# Altium schematic sheet Master-using-STM-V1-SCH.SchDoc
size 699 x 699 mm; SheetNumber: 1; SheetTotal: 1
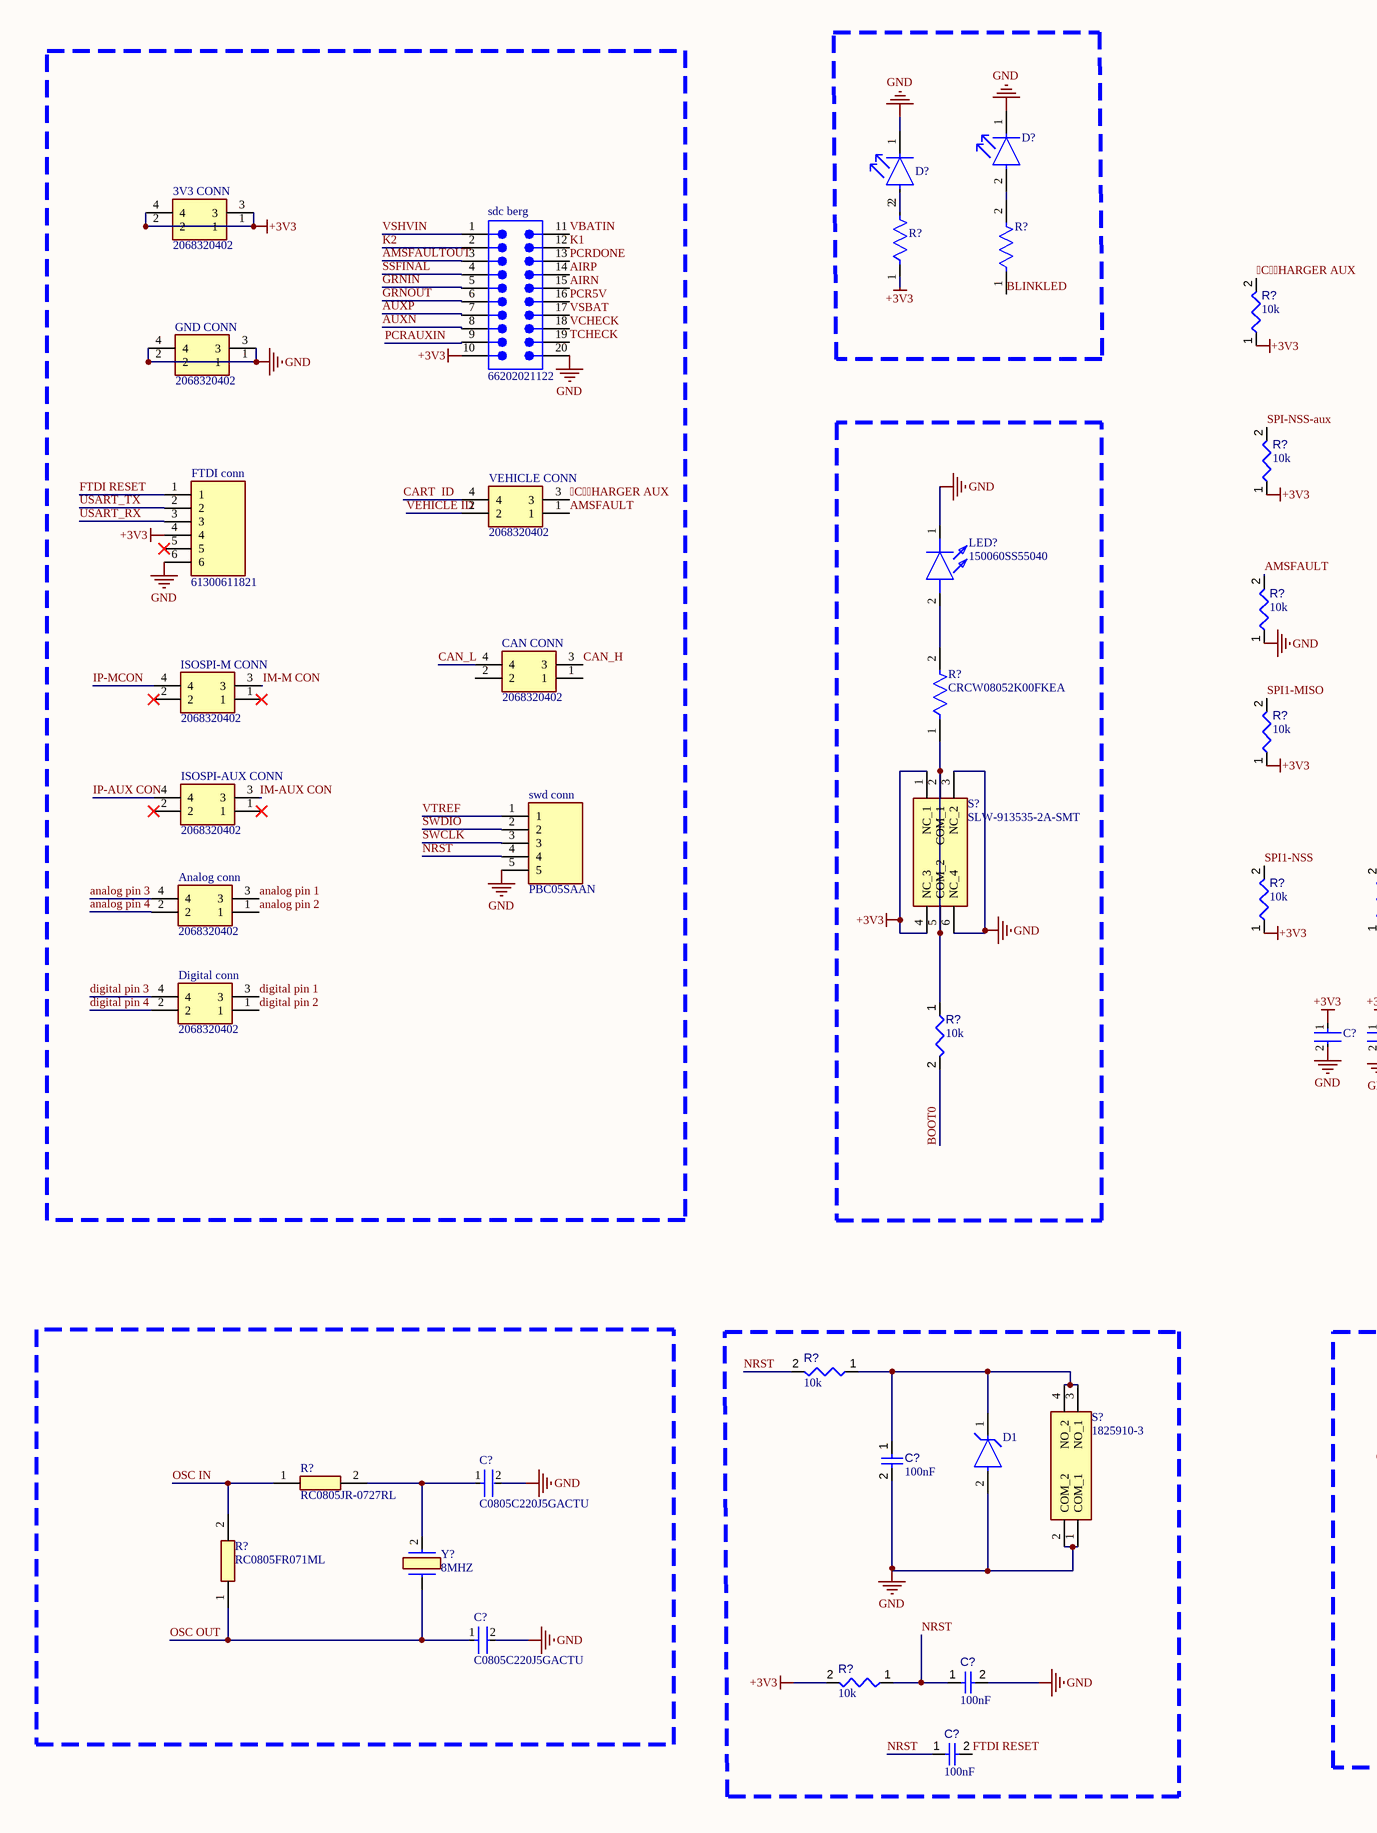
[diagram p0: Master-using-STM-V1-SCH.SchDoc, left]
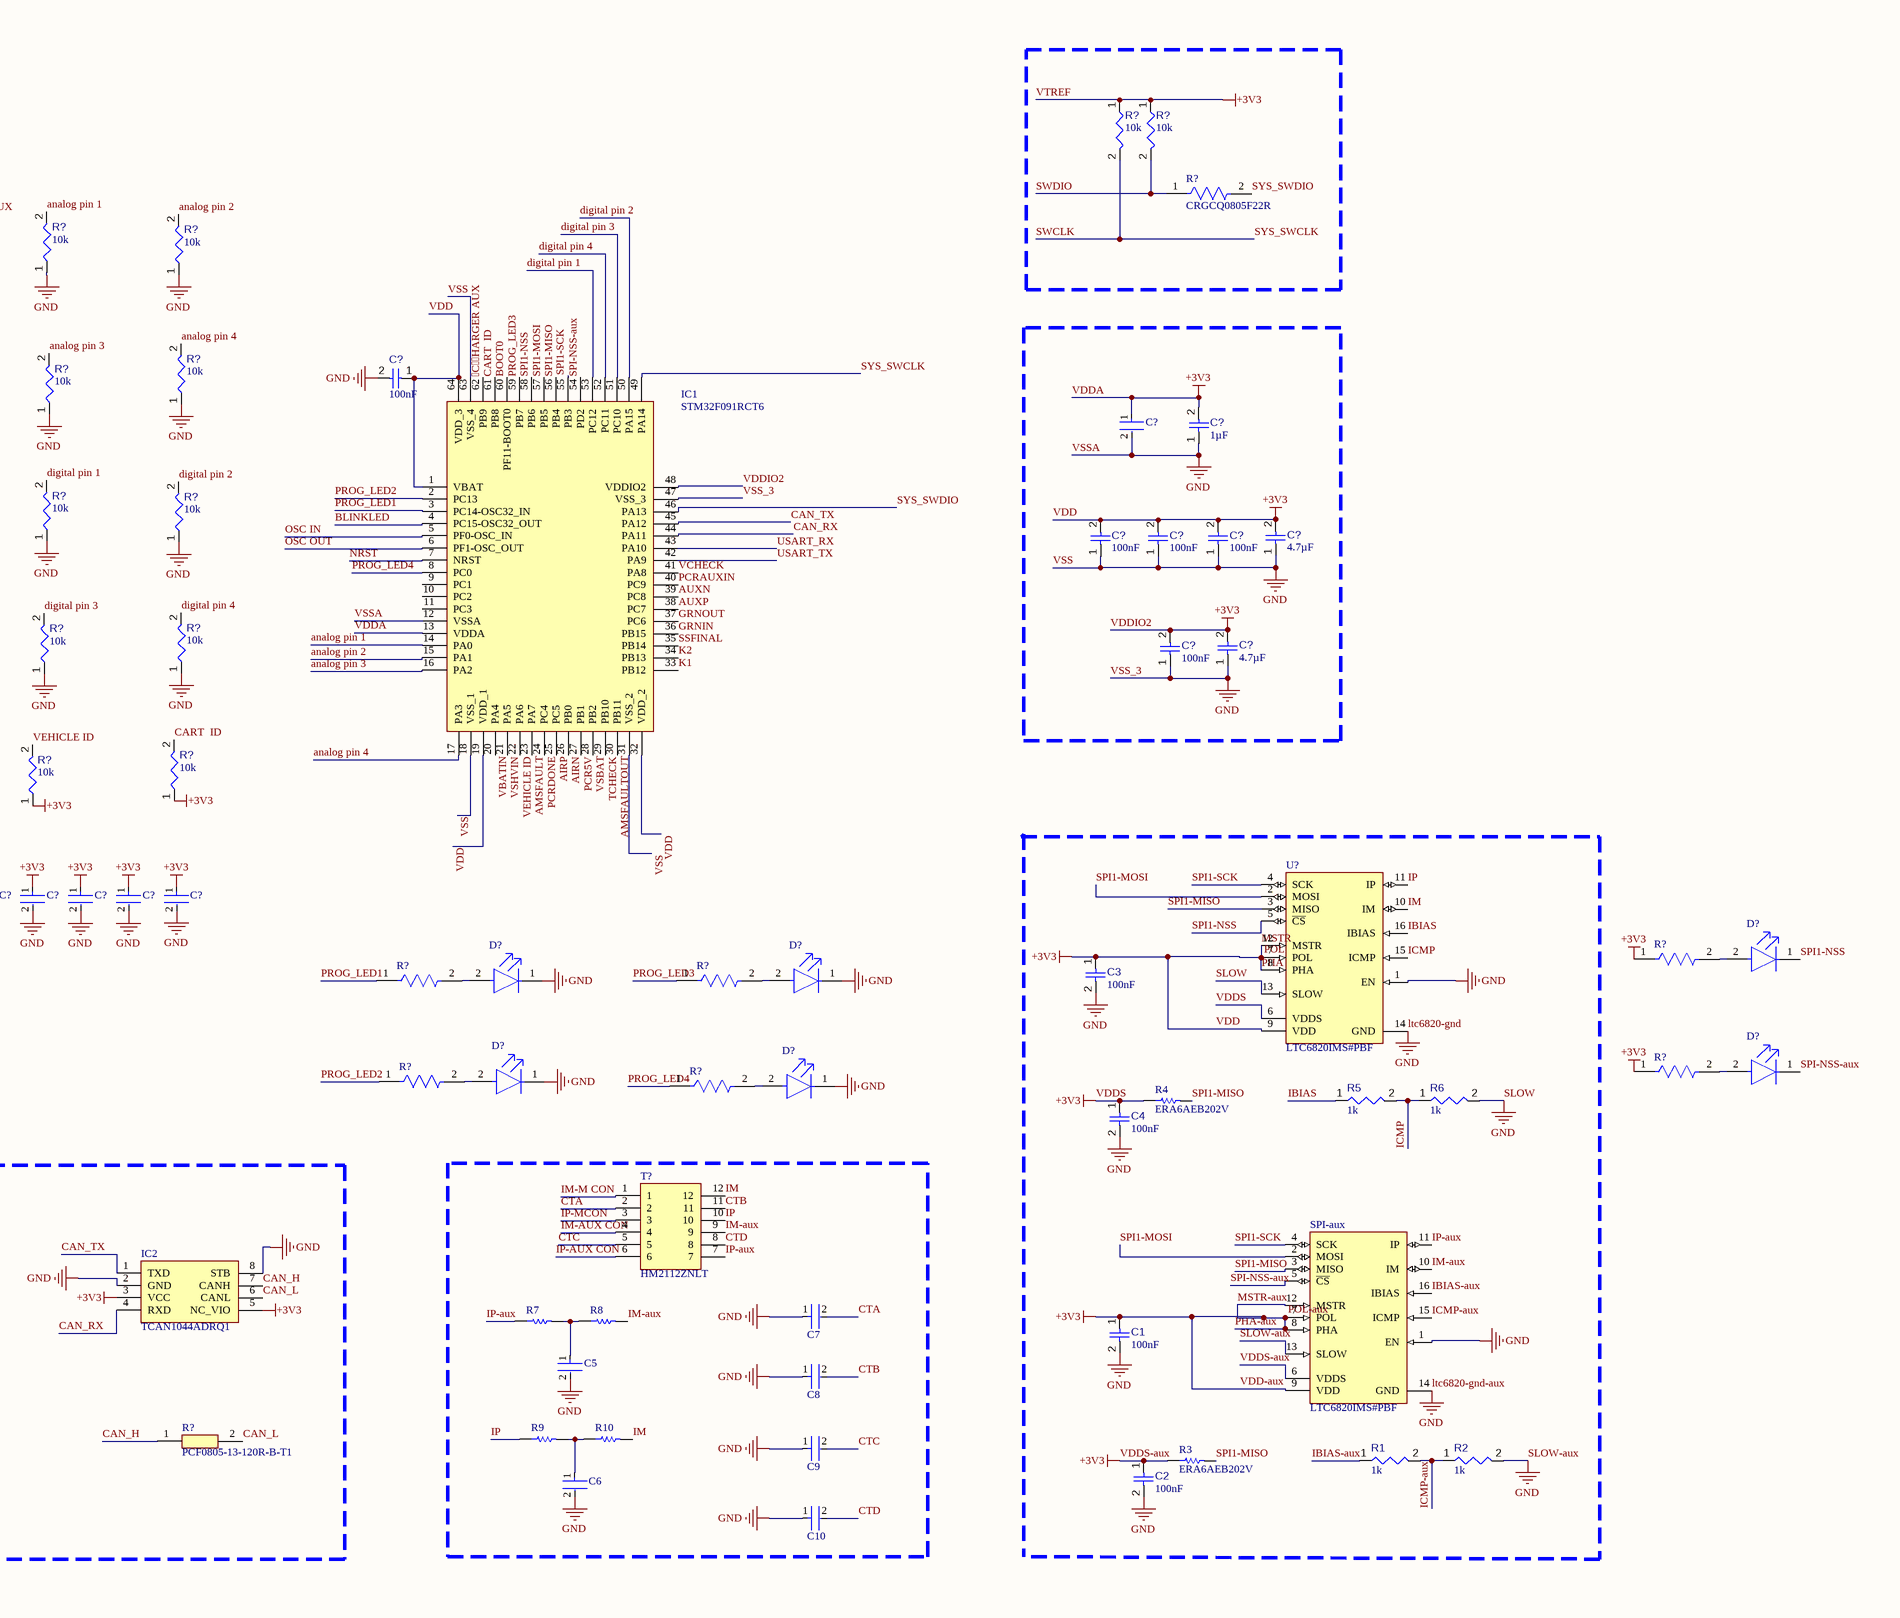
[diagram p1: Master-using-STM-V1-SCH.SchDoc, right]

## Parts
(Parts that share a designator on the sheet are numbered #1, #2 ... from top to bottom, then left to right.)
3V3_CONN  2068320402  [20683204YY]
Analog_conn  2068320402  [20683204YY]
C1  value 100nF  [CAPC2013X95X50LL10T25]  (hidden comment: Capacitor 100 nF +/-10% 50 V 0805)
C2  value 100nF  [CAPC2013X95X50LL10T25]  (hidden comment: Capacitor 100 nF +/-10% 50 V 0805)
C3  value 100nF  [CAPC2013X95X50LL10T25]  (hidden comment: Capacitor 100 nF +/-10% 50 V 0805)
C4  value 100nF  [CAPC2013X95X50LL10T25]  (hidden comment: Capacitor 100 nF +/-10% 50 V 0805)
C5  C0805C103K2RACTU  [FP-C0805C-DN-MFG]  (value not drawn)
C6  C0805C103K2RACTU  [FP-C0805C-DN-MFG]  (value not drawn)
C7  C0805C103K2RACTU  [FP-C0805C-DN-MFG]  (value not drawn)
C8  C0805C103K2RACTU  [FP-C0805C-DN-MFG]  (value not drawn)
C9  C0805C103K2RACTU  [FP-C0805C-DN-MFG]  (value not drawn)
C10  C0805C103K2RACTU  [FP-C0805C-DN-MFG]  (value not drawn)
C?#1  value 100nF  [CAPC2013X95X50LL10T25]  (hidden comment: Capacitor 100 nF +/-10% 50 V 0805)
C?#2  C0805C103K2RACTU  [FP-C0805C-DN-MFG]  (value not drawn)
C?#3  value 1µF  [CAPC2013X145X50ML20T25]  (hidden comment: Capacitor 1 uF +/- 10% 25 V 0805)
C?#4  value 4.7µF  [CAPC0805(2012)145_L]  (hidden comment: Capacitor 4.7µF +/-40% 25V 0805)
C?#5  value 100nF  [CAPC2013X95X50LL10T25]  (hidden comment: Capacitor 100 nF +/-10% 50 V 0805)
C?#6  value 100nF  [CAPC2013X95X50LL10T25]  (hidden comment: Capacitor 100 nF +/-10% 50 V 0805)
C?#7  value 100nF  [CAPC2013X95X50LL10T25]  (hidden comment: Capacitor 100 nF +/-10% 50 V 0805)
C?#8  value 100nF  [CAPC2013X95X50LL10T25]  (hidden comment: Capacitor 100 nF +/-10% 50 V 0805)
C?#9  value 4.7µF  [CAPC0805(2012)145_L]  (hidden comment: Capacitor 4.7µF +/-40% 25V 0805)
C?#10  C0805C103K2RACTU  [FP-C0805C-DN-MFG]  (value not drawn)
C?#11  C0805C103K2RACTU  [FP-C0805C-DN-MFG]  (value not drawn)
C?#12  C0805C103K2RACTU  [FP-C0805C-DN-MFG]  (value not drawn)
C?#13  C0805C103K2RACTU  [FP-C0805C-DN-MFG]  (value not drawn)
C?#14  C0805C103K2RACTU  [FP-C0805C-DN-MFG]  (value not drawn)
C?#15  value 100nF  [CAPC2013X95X50LL10T25]  (hidden comment: Capacitor 100 nF +/-10% 50 V 0805)
C?#16  C0805C220J5GACTU  [FP-C0805C-DN-MFG]
C?#17  C0805C220J5GACTU  [FP-C0805C-DN-MFG]
C?#18  value 100nF  [CAPC2013X95X50LL10T25]  (hidden comment: Capacitor 100 nF +/-10% 50 V 0805)
C?#19  value 100nF  [CAPC2013X95X50LL10T25]  (hidden comment: Capacitor 100 nF +/-10% 50 V 0805)
CAN_CONN  2068320402  [20683204YY]
D1  ESDALC6V1-1U2  [FP-ST0201-MFG]  (value not drawn)
D?#1  SML-LXT0805IW-TR  [FP-SML-LXT0805IW-TR-MFG]  (value not drawn)
D?#2  SML-LXT0805IW-TR  [FP-SML-LXT0805IW-TR-MFG]  (value not drawn)
D?#3  SML-LXT0805IW-TR  [FP-SML-LXT0805IW-TR-MFG]  (value not drawn)
D?#4  SML-LXT0805IW-TR  [FP-SML-LXT0805IW-TR-MFG]  (value not drawn)
D?#5  SML-LXT0805IW-TR  [FP-SML-LXT0805IW-TR-MFG]  (value not drawn)
D?#6  SML-LXT0805IW-TR  [FP-SML-LXT0805IW-TR-MFG]  (value not drawn)
D?#7  SML-LXT0805IW-TR  [FP-SML-LXT0805IW-TR-MFG]  (value not drawn)
D?#8  SML-LXT0805IW-TR  [FP-SML-LXT0805IW-TR-MFG]  (value not drawn)
Digital_conn  2068320402  [20683204YY]
FTDI_conn  61300611821  [RHDR6W97P0X254_1X6_1574X250X865P]
GND_CONN  2068320402  [20683204YY]
IC1  STM32F091RCT6  [QFP50P1200X1200X160-64N]
IC2  TCAN1044ADRQ1  [SOIC127P600X175-8N]
ISOSPI-AUX_CONN  2068320402  [20683204YY]
ISOSPI-M_CONN  2068320402  [20683204YY]
LED?  150060SS55040  [150060SS55040]
R1  value 1k  [RESC0805(2012)_L]  (hidden comment: 1KR5J)
R2  value 1k  [RESC0805(2012)_L]  (hidden comment: 1KR5J)
R3  ERA6AEB202V  [RESC2013X60X40ML20T25]
R4  ERA6AEB202V  [RESC2013X60X40ML20T25]
R5  value 1k  [RESC0805(2012)_L]  (hidden comment: 1KR5J)
R6  value 1k  [RESC0805(2012)_L]  (hidden comment: 1KR5J)
R7  RC0805FR-0749R9L  [RESC2013X60X35LL10T20]  (value not drawn)
R8  RC0805FR-0749R9L  [RESC2013X60X35LL10T20]  (value not drawn)
R9  RC0805FR-0749R9L  [RESC2013X60X35LL10T20]  (value not drawn)
R10  RC0805FR-0749R9L  [RESC2013X60X35LL10T20]  (value not drawn)
R?#1  value 10k  [RESC2013X50X35ML15T15]  (hidden comment: Resistor 10k +/-1% 0805 125 mW)
R?#2  value 10k  [RESC2013X50X35ML15T15]  (hidden comment: Resistor 10k +/-1% 0805 125 mW)
R?#3  CRGCQ0805F22R  [FP-CRGCQ0805-IPC_C]
R?#4  AC0805JR-07680RL  [FP-AC0805-MFG]  (value not drawn)
R?#5  AC0805JR-07680RL  [FP-AC0805-MFG]  (value not drawn)
R?#6  value 10k  [RESC2013X50X35ML15T15]  (hidden comment: Resistor 10k +/-1% 0805 125 mW)
R?#7  value 10k  [RESC2013X50X35ML15T15]  (hidden comment: Resistor 10k +/-1% 0805 125 mW)
R?#8  value 10k  [RESC2013X50X35ML15T15]  (hidden comment: Resistor 10k +/-1% 0805 125 mW)
R?#9  value 10k  [RESC2013X50X35ML15T15]  (hidden comment: Resistor 10k +/-1% 0805 125 mW)
R?#10  value 10k  [RESC2013X50X35ML15T15]  (hidden comment: Resistor 10k +/-1% 0805 125 mW)
R?#11  value 10k  [RESC2013X50X35ML15T15]  (hidden comment: Resistor 10k +/-1% 0805 125 mW)
R?#12  value 10k  [RESC2013X50X35ML15T15]  (hidden comment: Resistor 10k +/-1% 0805 125 mW)
R?#13  value 10k  [RESC2013X50X35ML15T15]  (hidden comment: Resistor 10k +/-1% 0805 125 mW)
R?#14  value 10k  [RESC2013X50X35ML15T15]  (hidden comment: Resistor 10k +/-1% 0805 125 mW)
R?#15  CRCW08052K00FKEA  [FP-CRCW0805-e3-IPC_B]
R?#16  value 10k  [RESC2013X50X35ML15T15]  (hidden comment: Resistor 10k +/-1% 0805 125 mW)
R?#17  value 10k  [RESC2013X50X35ML15T15]  (hidden comment: Resistor 10k +/-1% 0805 125 mW)
R?#18  value 10k  [RESC2013X50X35ML15T15]  (hidden comment: Resistor 10k +/-1% 0805 125 mW)
R?#19  value 10k  [RESC2013X50X35ML15T15]  (hidden comment: Resistor 10k +/-1% 0805 125 mW)
R?#20  value 10k  [RESC2013X50X35ML15T15]  (hidden comment: Resistor 10k +/-1% 0805 125 mW)
R?#21  value 10k  [RESC2013X50X35ML15T15]  (hidden comment: Resistor 10k +/-1% 0805 125 mW)
R?#22  value 10k  [RESC2013X50X35ML15T15]  (hidden comment: Resistor 10k +/-1% 0805 125 mW)
R?#23  AC0805JR-07680RL  [FP-AC0805-MFG]  (value not drawn)
R?#24  AC0805JR-07680RL  [FP-AC0805-MFG]  (value not drawn)
R?#25  AC0805JR-07680RL  [FP-AC0805-MFG]  (value not drawn)
R?#26  AC0805JR-07680RL  [FP-AC0805-MFG]  (value not drawn)
R?#27  AC0805JR-07680RL  [FP-AC0805-MFG]  (value not drawn)
R?#28  AC0805JR-07680RL  [FP-AC0805-MFG]  (value not drawn)
R?#29  value 10k  [RESC2013X50X35ML15T15]  (hidden comment: Resistor 10k +/-1% 0805 125 mW)
R?#30  RC0805JR-0727RL  [RESC2012X60N]
R?#31  RC0805FR071ML  [RESC2012X60N]
R?#32  PCF0805-13-120R-B-T1  [RESC2012X65N]
R?#33  value 10k  [RESC2013X50X35ML15T15]  (hidden comment: Resistor 10k +/-1% 0805 125 mW)
S?#1  SLW-913535-2A-SMT  [SLW9135352ASMT]
S?#2  1825910-3  [18259103]
sdc_berg  66202021122  [66202021122]
SPI-aux  LTC6820IMS#PBF  [LT-MS-16_L]
swd_conn  PBC05SAAN  [HDRV5W64P0X254_1X5_1270X254X858P]
T?  HM2112ZNLT  [HM2112ZNLT]
U?  LTC6820IMS#PBF  [LT-MS-16_L]
VEHICLE_CONN  2068320402  [20683204YY]
Y?  8MHZ  [12000MHzHC494H3050408518pFATF]

## Nets
ltc6820-gnd: C1.2 C2.2 C3.2 C4.2 C5.2 C6.2 C7.1 C8.1 C9.1 C10.1 C?#1.2 C?#2.2 C?#3.1 C?#4.1 C?#5.1 C?#6.1 C?#7.1 C?#8.1 C?#9.1 C?#11.2 C?#12.2 C?#13.2 C?#14.2 C?#15.2 C?#16.2 C?#17.2 C?#18.2 D1.2(A) D?#1.1(C) D?#2.1(C) D?#4.1(C) D?#5.1(C) D?#7.1(C) D?#8.1(C) FTDI_conn.6 GND_CONN.1 GND_CONN.2 GND_CONN.3 GND_CONN.4 IC1.12(VSSA) IC1.18(VSS_1) IC1.31(VSS_2) IC1.47(VSS_3) IC1.63(VSS_4) IC2.2(GND) IC2.8(STB) LED?.1(K) R2.2 R6.2 R?#7.1 R?#8.1 R?#10.1 R?#11.1 R?#12.1 R?#13.1 R?#14.1 R?#17.1 R?#18.1 S?#1.3(NC_2) S?#1.6(NC_4) S?#2.1(COM_1) S?#2.2(COM_2) sdc_berg.20 SPI-aux.1(EN) SPI-aux.13(SLOW) SPI-aux.14(GND) swd_conn.5 U?.1(EN) U?.13(SLOW) U?.14(GND)  [also labelled GND, ltc6820-gnd-aux, SLOW, SLOW-aux, VSS, VSS_3, VSSA]
MSTR: 3V3_CONN.1 3V3_CONN.2 3V3_CONN.3 3V3_CONN.4 C1.1 C2.1 C3.1 C4.1 C?#1.1 C?#2.1 C?#3.2 C?#4.2 C?#5.2 C?#6.2 C?#7.2 C?#8.2 C?#9.2 C?#10.1 C?#11.1 C?#12.1 C?#13.1 C?#14.1 FTDI_conn.4 IC1.1(VBAT) IC1.13(VDDA) IC1.19(VDD_1) IC1.32(VDD_2) IC1.48(VDDIO2) IC1.64(VDD_3) IC2.3(VCC) IC2.5(NC_VIO) R3.1 R4.1 R?#1.1 R?#2.1 R?#4.1 R?#6.1 R?#9.1 R?#16.1 R?#19.1 R?#20.1 R?#21.1 R?#23.1 R?#26.1 R?#33.2 S?#1.1(NC_1) S?#1.4(NC_3) sdc_berg.10 SPI-aux.6(VDDS) SPI-aux.7(POL) SPI-aux.8(PHA) SPI-aux.9(VDD) SPI-aux.12(MSTR) swd_conn.1 U?.6(VDDS) U?.7(POL) U?.8(PHA) U?.9(VDD) U?.12(MSTR)  [also labelled +3V3, MSTR-aux, PHA, PHA-aux, VDD, VDD-aux, VDDA, VDDIO2, VDDS, VDDS-aux, VTREF]
CHARGER AUX: IC1.62(PB9) R?#6.2 VEHICLE_CONN.3
AIRN: IC1.26(PB0) sdc_berg.15
AIRP: IC1.25(PC5) sdc_berg.14
AMSFAULT: IC1.23(PA7) R?#14.2 VEHICLE_CONN.1
AMSFAULTOUT: IC1.30(PB11) sdc_berg.3
analog pin 1: Analog_conn.3 IC1.14(PA0) R?#7.2
analog pin 2: Analog_conn.1 IC1.15(PA1) R?#8.2
analog pin 3: Analog_conn.4 IC1.16(PA2) R?#11.2
analog pin 4: Analog_conn.2 IC1.17(PA3) R?#10.2
AUXN: IC1.39(PC8) sdc_berg.8
AUXP: IC1.38(PC7) sdc_berg.7
BLINKLED: IC1.4(PC15-OSC32_OUT) R?#5.1
BOOT0: IC1.60(PF11-BOOT0) R?#22.2
CAN_H: CAN_CONN.3 IC2.7(CANH) R?#32.1
CAN_L: CAN_CONN.4 IC2.6(CANL) R?#32.2
CAN_RX: IC1.44(PA11) IC2.4(RXD)
CAN_TX: IC1.45(PA12) IC2.1(TXD)
CART  ID: IC1.61(PB8) R?#21.2 VEHICLE_CONN.4
CTA: C7.2 T?.2
CTB: C8.2 T?.11
CTC: C9.2 T?.5
CTD: C10.2 T?.8
digital pin 1: Digital_conn.3 IC1.53(PC12) R?#12.2
digital pin 2: Digital_conn.1 IC1.50(PA15) R?#13.2
digital pin 3: Digital_conn.4 IC1.51(PC10) R?#17.2
digital pin 4: Digital_conn.2 IC1.52(PC11) R?#18.2
FTDI RESET: C?#19.2 FTDI_conn.1
GRNIN: IC1.36(PB15) sdc_berg.5
GRNOUT: IC1.37(PC6) sdc_berg.6
IBIAS: R5.1 U?.16(IBIAS)
IBIAS-aux: R1.1 SPI-aux.16(IBIAS)
ICMP: R5.2 R6.1 U?.15(ICMP)
ICMP-aux: R1.2 R2.1 SPI-aux.15(ICMP)
IM: R10.2 T?.12 U?.10(IM)
IM-aux: R8.2 SPI-aux.10(IM) T?.9
IM-AUX CON: ISOSPI-AUX_CONN.3 T?.4
IM-M CON: ISOSPI-M_CONN.3 T?.1
IP: R9.1 T?.10 U?.11(IP)
IP-aux: R7.1 SPI-aux.11(IP) T?.7
IP-AUX CON: ISOSPI-AUX_CONN.4 T?.6
IP-MCON: ISOSPI-M_CONN.4 T?.3
K1: IC1.33(PB12) sdc_berg.12
K2: IC1.34(PB13) sdc_berg.2
NRST: C?#18.1 C?#19.1 IC1.7(NRST) R?#29.2 R?#33.1 swd_conn.4
OSC IN: IC1.5(PF0-OSC_IN) R?#30.1 R?#31.2
OSC OUT: C?#17.1 IC1.6(PF1-OSC_OUT) R?#31.1 Y?.?1
PCR5V: IC1.27(PB1) sdc_berg.16
PCRAUXIN: IC1.40(PC9) sdc_berg.9
PCRDONE: IC1.24(PC4) sdc_berg.13
PROG_LED1: IC1.3(PC14-OSC32_IN) R?#24.1
PROG_LED2: IC1.2(PC13) R?#27.1
PROG_LED3: IC1.59(PB7) R?#25.1
PROG_LED4: IC1.8(PC0) R?#28.1
SPI1-MISO: IC1.56(PB4) R3.2 R4.2 R?#16.2 SPI-aux.3(MISO) U?.3(MISO)
SPI1-MOSI: IC1.57(PB5) SPI-aux.2(MOSI) U?.2(MOSI)
SPI1-NSS: D?#3.1(C) IC1.58(PB6) R?#19.2 U?.5(~{CS})
SPI1-SCK: IC1.55(PB3) SPI-aux.4(SCK) U?.4(SCK)
SPI-NSS-aux: D?#6.1(C) IC1.54(PD2) R?#9.2 SPI-aux.5(~{CS})
SSFINAL: IC1.35(PB14) sdc_berg.4
SWCLK: IC1.49(PA14) R?#1.2 swd_conn.3  [also labelled SYS_SWCLK]
SWDIO: R?#2.2 R?#3.1 swd_conn.2
SYS_SWDIO: IC1.46(PA13) R?#3.2
TCHECK: IC1.29(PB10) sdc_berg.19
USART_RX: FTDI_conn.3 IC1.43(PA10)
USART_TX: FTDI_conn.2 IC1.42(PA9)
VBATIN: IC1.20(PA4) sdc_berg.11
VCHECK: IC1.41(PA8) sdc_berg.18
VEHICLE ID: IC1.22(PA6) R?#20.2 VEHICLE_CONN.2
VSBAT: IC1.28(PB2) sdc_berg.17
VSHVIN: IC1.21(PA5) sdc_berg.1
NetC5_1: C5.1 R7.2 R8.1
NetC6_1: C6.1 R9.2 R10.1
NetC?#15_1: C?#15.1 D1.1(C) R?#29.1 S?#2.3(NO_1) S?#2.4(NO_2)
NetC?#16_1: C?#16.1 R?#30.2 Y?.2(CRYSTAL_2)
NetD?#1_2: D?#1.2(A) R?#5.2
NetD?#2_2: D?#2.2(A) R?#4.2
NetD?#3_2: D?#3.2(A) R?#23.2
NetD?#4_2: D?#4.2(A) R?#24.2
NetD?#5_2: D?#5.2(A) R?#25.2
NetD?#6_2: D?#6.2(A) R?#26.2
NetD?#7_2: D?#7.2(A) R?#27.2
NetD?#8_2: D?#8.2(A) R?#28.2
NetLED?_2: LED?.2(A) R?#15.2
NetR?#15_1: R?#15.1 R?#22.1 S?#1.2(COM_1) S?#1.5(COM_2)

Not connected (* = marked no-connect by the designer): C?#10 2; CAN_CONN 1 2; FTDI_conn 5*; IC1 9(PC1) 10(PC2) 11(PC3); ISOSPI-AUX_CONN 1* 2*; ISOSPI-M_CONN 1* 2*

## Notes on the sheet
- Labels drawn without touching a wire or pin: GND, POL, POL-aux

## Library data of the parts
3V3_CONN Analog_conn CAN_CONN Digital_conn GND_CONN ISOSPI-AUX_CONN ISOSPI-M_CONN VEHICLE_CONN = 2068320402: Connector; Manufacturer_Name: Molex; Datasheet Link: https://www.molex.com/pdm_docs/sd/2068320201_sd.pdf; Height: 6.7mm; Manufacturer_Part_Number: 2068320402
C1-C4 C?#1 C?#5-C?#8 C?#15 C?#18 C?#19 = CMP-001-00018-6: Chip Capacitor, 100 nF, +/- 10%, 50 V, 0805 (2012 Metric); Capacitor Type: Ceramic; Voltage Rating: 50V; Pins: 2; Max Operating Temperature: 125°C; Min Operating Temperature: -55°C; Mounting Technology: SM; Case/Package: 0805; RoHS Compliant: True; Tolerance: 10%
C5-C10 = CMP-2007-00259-2: CAP CER 10000PF 200V X7R 0805; Manufacturer: KEMET; Material: Ceramic; Temperature Coefficient: 30ppm/°C; Capacitance: 10,000 pF; Tolerance: 0.1; Value: 10,000 pF; Device Class L2: Capacitors; Voltage Rating: 200 V; Temperature Range High: +125°C; ComponentLink2Description: Datasheet; Height: 0.88mm; Octopart: https://octopart.com/c0805c103k2ractu-kemet-9138347; ComponentLink2URL: https://content.kemet.com/datasheets/KEM_C1003_C0G_SMD.pdf; Category: Cap; Temperature: -55°C to +125°C; Temperature Range Low: -55°C; Digikey Description: CAP CER 10000PF 200V X7R 0805; Manufacturer Part Number: C0805C103K2RACTU; Temperature Characteristic: X7R; Automotive: No; Device Class L3: Ceramic Capacitors; Mouser Description: KEMET - C0805C103K2RACTU - CAP, MLCC, X7R, 10NF, 200V, 0805; RoHS: TRUE; Device Class L1: Passive Components; Lead Free: Yes; Package: C0805C-DN; Ipc Land Pattern Name: CAPC200125X78
C?#2 C?#10-C?#14 = CMP-2007-00259-2: CAP CER 10000PF 200V X7R 0805; Manufacturer: KEMET; Material: Ceramic; Temperature Coefficient: 30ppm/°C; Capacitance: 10,000 pF; Description: C0805 10,000 pF X7R 30ppm/°C 10.00% 200 V; Tolerance: 0.1; Value: 10,000 pF; Device Class L2: Capacitors; Voltage Rating: 200 V; Temperature Range High: +125°C; ComponentLink2Description: Datasheet; Height: 0.88mm; Octopart: https://octopart.com/c0805c103k2ractu-kemet-9138347; ComponentLink2URL: https://content.kemet.com/datasheets/KEM_C1003_C0G_SMD.pdf; Category: Cap; Temperature: -55°C to +125°C; Temperature Range Low: -55°C; Digikey Description: CAP CER 10000PF 200V X7R 0805; Manufacturer Part Number: C0805C103K2RACTU; Temperature Characteristic: X7R; Automotive: No; Device Class L3: Ceramic Capacitors; Mouser Description: KEMET - C0805C103K2RACTU - CAP, MLCC, X7R, 10NF, 200V, 0805; RoHS: TRUE; Device Class L1: Passive Components; Lead Free: Yes; Package: C0805C-DN; Ipc Land Pattern Name: CAPC200125X78
C?#3 = CMP-001-00010-6: Chip Capacitor, 1 uF, +/-10%, 25 V, 0805 (2012 Metric); Capacitor Type: Ceramic; Voltage Rating: 25V; RoHS Compliant: True; Pins: 2; Mounting Technology: SM; Max Operating Temperature: 125°C; Min Operating Temperature: -55°C; Tolerance: 10%; Case/Package: 0805
C?#4 C?#9 = CMP-001-00080-4: Chip Capacitor, 4.7µF +/-40%, 25V, 0805, Thickness 1.45 mm; Tolerance: 20%; Voltage Rating: 25V; Min Operating Temperature: -55°C; Max Operating Temperature: 85°C; Pins: 2; Mounting Technology: SMT; Case/Package: 0805
C?#16 C?#17 = CMP-2007-00048-2: Capacitor; Ceramic; Cap; 22.0pF; Tol 5%; SMT; Vol-Rtg 50V; C0G; Tape and Reel; Manufacturer: KEMET; Temperature Coefficient: 30ppm/°C; Capacitance: 22 pF; Value: 22 pF; Description: C0805 22 pF C0G 30ppm/°C 5.00% 50 V; Tolerance: 0.05; Device Class L1: Passive Components; Mouser Description: Multilayer Ceramic Capacitors MLCC - SMD/SMT 50volts 22pF C0G 5%; Temperature Range Low: -55°C; Automotive: No; Voltage Rating: 50 V; Material: Ceramic; Category: Cap; Height: 0.88mm; Temperature Range High: +125°C; Digikey Description: Capacitor; Ceramic; Cap; 22.0pF; Tol 5%; SMT; Vol-Rtg 50V; C0G; Tape and Reel; Octopart: https://octopart.com/c0805c220j5gactu-kemet-145470; ComponentLink2Description: Datasheet; Device Class L2: Capacitors; Ipc Land Pattern Name: CAPC200125X78; RoHS: TRUE; ComponentLink2URL: https://content.kemet.com/datasheets/KEM_C1003_C0G_SMD.pdf; Temperature: -55°C to +125°C; Device Class L3: Ceramic Capacitors; Lead Free: Yes; Manufacturer Part Number: C0805C220J5GACTU; Temperature Characteristic: C0G; Package: C0805C-DN
D1 = CMP-12225-000007-1: TVS DIODE 3V ST0201; Manufacturer: STMicroelectronics; Number Of Channels: 1; Direction: Unidirectional; Max Junction Temp: +125°C; Breakdown Voltage: 6.1V; Capacitance: 12pF; Peak Pulse Current: 2A; Value: 12pF; Peak Pulse Power: 20W; Package: ST0201; Digikey Description: TVS DIODE 3V ST0201; Temperature Range High: +125°C; Octopart: https://octopart.com/esdalc6v1-1u2-stmicroelectronics-11912330; Category: Diode; Height: 0.33mm; RoHS: TRUE; ComponentLink2URL: https://www.st.com/content/ccc/resource/technical/document/datasheet/90/b1/aa/a3/9f/73/4d/1e/CD00212838.pdf/files/CD00212838.pdf/jcr:content/translations/en.CD00212838.pdf; Temperature Range Low: -40°C; Device Class L2: TVS Diodes; ComponentLink2Description: Datasheet; Manufacturer Part Number: ESDALC6V1-1U2; Device Class L1: Circuit Protection; Device Class L3: unset; Lead Free: Yes; Automotive: No; Mouser Description: TVS Diodes - Transient Voltage Suppressors Single-Line Low Cap ESD TVS 0201; Temperature: -40°C to +125°C
D?#1-D?#8 = CMP-1724-00002-2: LED RED DIFFUSED SMD; Lens Style: Rectangular; Luminous Intensity: 11mcd; Approvals: UL; Test Current: 20mA; Forward Voltage: 2V; Number of LEDs: 1; Wavelength: 635nm; Lens Color: White; Viewing Angle: 140°; Min Operating Temperature: -25°C; Case Code (Metric): 2012; Mount: Surface Mount; Case Code (Imperial): 0805; Height: 0.8mm; Lead Free: Lead Free; Color: Red; Package Quantity: 1; Illumination Color: Red; Lens Transparency: Diffused; Forward Current: 20mA; Packaging: Tape and Reel; Length: 2mm; Case/Package: 0805; REACH SVHC: No SVHC; Width: 1.25mm; Number of Pins: 2; Max Operating Temperature: 80°C; Dominant Wavelength: 635nm
FTDI_conn = 61300611821: Connector; Manufacturer_Name: Wurth Elektronik; Datasheet Link: https://www.we-online.de/katalog/datasheet/61300611821.pdf; Height: 8.65mm; Manufacturer_Part_Number: 61300611821; Mouser Part Number: 710-61300611821; Mouser Price/Stock: https://www.mouser.co.uk/ProductDetail/Wurth-Elektronik/61300611821?qs=iLbezkQI%252BsgS21jF2eozhA%3D%3D
IC1 = STM32F091RCT6: Integrated Circuit; Manufacturer_Name: STMicroelectronics; Datasheet Link: http://www.st.com/content/ccc/resource/technical/document/datasheet/95/3c/2e/5b/21/09/45/a6/DM00115237.pdf/files/DM00115237.pdf/jcr:content/translations/en.DM00115237.pdf; Height: 1.6mm; Manufacturer_Part_Number: STM32F091RCT6; Mouser Part Number: 511-STM32F091RCT6; Mouser Price/Stock: https://www.mouser.co.uk/ProductDetail/STMicroelectronics/STM32F091RCT6?qs=ClYTdQWm4hDCc82GnPpqOQ%3D%3D; Arrow Part Number: STM32F091RCT6; Arrow Price/Stock: https://www.arrow.com/en/products/stm32f091rct6/stmicroelectronics
IC2 = TCAN1044ADRQ1: Integrated Circuit; Manufacturer_Name: Texas Instruments; Datasheet Link: https://www.ti.com/lit/gpn/tcan1044a-q1; Height: 1.75mm; Manufacturer_Part_Number: TCAN1044ADRQ1; Mouser Part Number: 595-TCAN1044ADRQ1; Mouser Price/Stock: https://www.mouser.co.uk/ProductDetail/Texas-Instruments/TCAN1044ADRQ1?qs=Rp5uXu7WBW8dWvWIzPpGFg%3D%3D; Arrow Part Number: TCAN1044ADRQ1; Arrow Price/Stock: https://www.arrow.com/en/products/tcan1044adrq1/texas-instruments?region=nac
LED? = 150060SS55040: LED; Manufacturer_Name: Wurth Elektronik; Datasheet Link: https://www.mouser.com/datasheet/2/445/150060SS55040-1714139.pdf; Manufacturer_Part_Number: 150060SS55040; Mouser Part Number: 710-150060SS55040; Mouser Price/Stock: https://www.mouser.co.uk/ProductDetail/Wurth-Elektronik/150060SS55040?qs=8Aam6%252B7C6HG0AGgMR5PhFg%3D%3D
R1 R2 R5 R6 = CMP-009-00076-2: 1K 0.125W 5% 0805 (2012 Metric)  SMD; Power: 125mW; Pins: 2; Mounting Technology: SMT; Tolerance: 5%; Case/Package: 0805
R3 R4 = CMP-2001-00609-1: Manufacturer: Panasonic; Part Number: ERA6AEB202V
R7-R10 = CMP-2000-06962-1: Chip Resistor, 49.9 Ohm, +/- 1%, 125 mW, -55 to 155 degC, 0805 (2012 Metric), RoHS, Tape and Reel; Manufacturer: Yageo; Resistance: 49.9Ohms; Power Rating: 125mW(1/8W); Voltage Rating: 150V; Temperature Coefficient: 100PPM/C; Operating Temperature Range: -55Cto+155C; Packaging: Reel; Package Reference: 0805; Case Code - mm: 2012; Series: RC; Termination Style: SMD/SMT; Manufacturer URL: http://www.yageo.com/; Mounting Technology: SurfaceMount; Package Description: 2-Pin Surface Mounted Device, Body 2 x 1.25 mm; Datasheet URL: http://www.yageo.com/documents/recent/PYu-RC_Group_51_RoHS_L_7.pdf; Datasheet Version: Rev. 7, 05/2017; Product: ThickFilmResistorsGeneralPurpose; Case Code - in: 0805; Tolerance: 1%
R?#1 R?#2 R?#6-R?#14 R?#16-R?#22 R?#29 R?#33 = CMP-009-00018-5: Chip Resistor, 10 KOhm, +/- 1%, 125 mW, -55 to 155 degC, 0805 (2012 Metric); Power: 125mW; Voltage Rating: 150V; Tolerance: 1%; Pins: 2; Min Operating Temperature: -55°C; Case/Package: 0805; Max Operating Temperature: 155°C; RoHS Compliant: True; Mounting Technology: SM
R?#3 = CMP-03211-006853-1: CRGCQ 0805 22R 1%; Manufacturer: TE Connectivity; Voltage Rating: 150V; Description: CRGCQ0805 22Ω 0.125W ±200ppm/°C 1% 150V; Tolerance: 0.01; Power Rating: 0.125W; Resistance: 22Ω; Value: 22Ω; Automotive Grade: Grade 301; Temperature Coefficient: ±200ppm/°C; Temperature: -55°C to +155°C; Digikey Description: CRGCQ 0805 22R 1%; Ipc Land Pattern Name: RESC200125X55; Temperature Range Low: -55°C; ComponentLink2URL: https://www.te.com/commerce/DocumentDelivery/DDEController?Action=showdoc&DocId=Data+Sheet%7F1773204-3%7F1%7Fpdf%7FEnglish%7FENG_DS_1773204-3_1.pdf%7F4-2176341-310; Package: CRGCQ0805; Octopart: https://octopart.com/crgcq0805f22r-te+connectivity-91018162; Height: 0.65mm; Ambient Temperature Range High: +70°C; Manufacturer Part Number: CRGCQ0805F22R; Device Class L2: Resistors; Composition: Thick Film; Temperature Range High: +155°C; Device Class L3: Chip SMD Resistors; RoHS: TRUE; Lead Free: Yes; Mouser Description: SMD AEC-Q200 Compliant Thick Film Chip Resistor; Device Class L1: Passive Components; ComponentLink2Description: Datasheet; Series: CRGCQ; Category: Res; Automotive: Yes
R?#4 R?#5 R?#23-R?#28 = CMP-2001-04475-2: RES SMD 680 OHM 5% 1/8W 0805; Manufacturer: Yageo; Voltage Rating: 150V; Tolerance: 0.05; Resistance: 680Ω; Value: 680Ω; Automotive Grade: Grade 0; Mouser Description: Thick Film Resistors - SMD 1/8W 680ohm 5% AEC-Q200; Ipc Land Pattern Name: RESC200125X50; ComponentLink2Description: Datasheet; Power Rating: 1/8W; Automotive: Yes; Device Class L3: Chip SMD Resistors; Device Class L1: Passive Components; Series: AC; RoHS: TRUE; Temperature: -55°C to +155°C; Composition: Thick Film; ComponentLink2URL: http://www.yageo.com/documents/recent/PYu-AC_51_RoHS_L_6.pdf; Digikey Description: RES SMD 680 OHM 5% 1/8W 0805; Footprint Url: http://www.yageo.com/exep/pages/download/literatures/PYu-R_Mount_10.pdf; Height: 0.6mm; Temperature Range Low: -55°C; Package: AC0805; Category: Res; Manufacturer Part Number: AC0805JR-07680RL; Octopart: https://octopart.com/ac0805jr-07680rl-yageo-26185516; Device Class L2: Resistors; Temperature Range High: +155°C; Lead Free: Yes
R?#15 = CMP-2001-03755-2: RES Thick Film, 2kΩ, 1%, 0.125W, 100ppm/°C, 0805; Working Voltage: 150V; Max Power Dissipation: 125mW; Resistance: 2kR; Package Quantity: 10; Case Code (Metric): 2012; Voltage Rating: 150V; Number of Terminations: 2; Max Operating Temperature: 155°C; Depth: 1.25mm; Tolerance: 1%; Power Rating: 125mW; Lead Free: Lead Free; Case/Package: 0805; Features: Automotive AEC-Q200; Min Operating Temperature: -55°C; Termination: SMD/SMT; Case Code (Imperial): 0805; Weight: 0.000194oz; Packaging: Tape and Reel; Military Standard: Not; Radiation Hardening: No; Contact Plating: Tin; Mount: Surface Mount; Temperature Coefficient: 100ppm/°C; Height: 0.02inch; Number of Terminals: 2; Voltage Rating (DC): 150V; Number of Pins: 2; Length: 2mm; Width: 1.25mm; Composition: Thick Film
R?#30 = RC0805JR-0727RL: Resistor; Manufacturer_Name: KEMET; Datasheet Link: http://www.yageo.com/documents/recent/PYu-RC_Group_51_RoHS_L_10.pdf; Height: 0.6mm; Manufacturer_Part_Number: RC0805JR-0727RL; Mouser Part Number: 603-RC0805JR-0727RL; Mouser Price/Stock: https://www.mouser.com/Search/Refine.aspx?Keyword=603-RC0805JR-0727RL; Arrow Part Number: RC0805JR-0727RL; Arrow Price/Stock: https://www.arrow.com/en/products/rc0805jr-0727rl/yageo
R?#31 = RC0805FR071ML: Resistor; Manufacturer_Name: KEMET; Datasheet Link: https://www.yageo.com/upload/media/product/productsearch/datasheet/rchip/PYu-RC_Group_51_RoHS_L_11.pdf; Height: 0.6mm; Manufacturer_Part_Number: RC0805FR071ML; Arrow Part Number: RC0805FR071ML; Arrow Price/Stock: https://www.arrow.com/en/products/rc0805fr-071ml/yageo
R?#32 = PCF0805-13-120R-B-T1: Resistor; Manufacturer_Name: TT Electronics; Datasheet Link: https://componentsearchengine.com/Datasheets/1/PCF0805-13-10KBT1.pdf; Height: 0.65mm; Manufacturer_Part_Number: PCF0805-13-120R-B-T1
S?#1 = CMP-011-00014-1: Switch; Manufacturer_Name: Same Sky; Mouser Price/Stock: https://www.mouser.co.uk/ProductDetail/CUI-Devices/SLW-913535-2A-SMT?qs=1Kr7Jg1SGW948I6fIY1VRA%3D%3D; Arrow Price/Stock: https://www.arrow.com/en/products/slw-913535-2a-smt/cui-devices?region=nac; Mouser Part Number: 179-SLW-913535-2ASMT; Design Item ID: SLW-913535-2A-SMT; Manufacturer_Part_Number: SLW-913535-2A-SMT; Height: 5.9mm; Datasheet Link: https://www.cuidevices.com/product/resource/pdf/slw-913535-2a-smt.pdf; Source: SamacSys.SchLib; Arrow Part Number: SLW-913535-2A-SMT
S?#2 = CMP-011-00013-1: Switch; Manufacturer_Name: TE Connectivity; Manufacturer_Part_Number: 1825910-3; Arrow Price/Stock: https://www.arrow.com/en/products/1825910-3/te-connectivity?region=nac; Source: SamacSys.SchLib; Datasheet Link: http://uk.rs-online.com/web/p/products/4791407; Height: 4.3mm; Arrow Part Number: 1825910-3; Design Item ID: 1825910-3; Mouser Price/Stock: https://www.mouser.co.uk/ProductDetail/TE-Connectivity/1825910-3?qs=bdENzIhz2rnPyBgKfIxERA%3D%3D; Mouser Part Number: N/A
sdc_berg = CMP-1502-00317-2: NexarPartId: 23024755; Insulation Resistance: 1GΩ; Pitch: 3mm; Current Rating: 5A; Number of Positions: 20; Connector Type: Male Pin, Socket; Gender: Male; Row Spacing: 2.9972mm; Operating Supply Voltage: 250V; Contact Resistance: 10mΩ; Orientation: Vertical; RoHS: Compliant; REACH SVHC: Unknown; Number of Contacts: 20; Lead Pitch: 3mm; Mount: Through Hole; Fastening Type: Ramp; Contact Material: Copper; Color: Black; Height: 9.9mm; Length: 33.7mm; Termination: Kinked Pin; Width: 33.7mm; Number of Rows: 2; Min Operating Temperature: -40°C; Contact Plating: Tin; Max Operating Temperature: 105°C; Number of Pins: 20
SPI-aux U? = CMP-0937-00012-1: IsoSPI Isolated Communication Interface, 2.7 to 5.5 V, -40 to 85 degC, 16-Pin MSOP (MS), Pb-Free; Manufacturer: Linear Technology; Receiver Input Resistance: 35 kOhm; IO Supply Current: 1 uA Max.; Supply Current, IDLE State: 2 uA; IO Supply Voltage Range: 1.7 to 5.5 V; VBIAS: 1.9 to 2.1 V; ComponentLink3Description: Package Specification; PackageDescription: 16-Pin Micro Small Outline Package, Body 4.039 x 3 mm, Pitch 0.5 mm; PackageVersion: Rev. A; Temperature Range (degC): -40 to 85; PackageReference: MS-16; DatasheetVersion: Rev. A; ComponentLink2URL: http://cds.linear.com/docs/en/datasheet/6820fa.pdf; Power Supply: 2.7 to 5.5 V; Mounting Technology: Surface Mount; ComponentLink1URL: http://www.linear.com/; ComponentLink3URL: http://cds.linear.com/docs/en/packaging/05081669_A_MS16.pdf; PartNumber: LTC6820IMS#PBF; ComponentLink2Description: Datasheet; ComponentLink1Description: Manufacturer URL
swd_conn = PBC05SAAN: Connector; Manufacturer_Name: Sullins; Datasheet Link: https://drawings-pdf.s3.amazonaws.com/C10436.pdf; Height: 8.58mm; Manufacturer_Part_Number: PBC05SAAN
T? = CMP-012-00002-1: Transformer; Manufacturer_Name: Pulse Electronics; Arrow Part Number: HM2112ZNLT; Arrow Price/Stock: https://www.arrow.com/en/products/hm2112znlt/pulse-electronics-corporation?region=nac; Mouser Part Number: 673-HM2112ZNLT; Mouser Price/Stock: https://www.mouser.co.uk/ProductDetail/Pulse-Electronics/HM2112ZNLT?qs=lYGu3FyN48dcF18eDh4GjA%3D%3D; Design Item ID: HM2112ZNLT; Datasheet Link: https://www.mouser.com/datasheet/2/336/HM2112ZNL-1224892.pdf; Source: SamacSys.SchLib; Manufacturer_Part_Number: HM2112ZNLT; Height: 3.45mm
Y? = 12.000MHz_HC49_4H_30_50_-40+85_18pF_ATF: Crystal or Oscillator; Manufacturer_Name: EUROQUARTZ; Manufacturer_Part_Number: 12.000MHz HC49/4H/30/50/-40+85/18pF/ATF; Height: 3.5mm